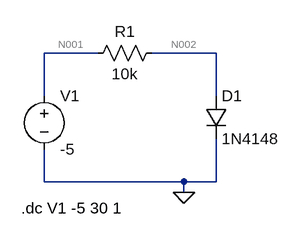
[diagram p0: schematic 1_1-10kohm.asc]
1_1-10kohm.asc, the LTspice schematic file:
Version 4
SHEET 1 880 680
WIRE 176 64 96 64
WIRE 352 64 256 64
WIRE 96 128 96 64
WIRE 352 128 352 64
WIRE 96 256 96 208
WIRE 304 256 96 256
WIRE 352 256 352 192
WIRE 352 256 304 256
WIRE 304 272 304 256
FLAG 304 272 0
SYMBOL voltage 96 112 R0
WINDOW 123 0 0 Left 0
WINDOW 39 0 0 Left 0
SYMATTR InstName V1
SYMATTR Value -5
SYMBOL res 272 48 R90
WINDOW 0 0 56 VBottom 2
WINDOW 3 32 56 VTop 2
SYMATTR InstName R1
SYMATTR Value 10k
SYMBOL diode 336 128 R0
SYMATTR InstName D1
SYMATTR Value 1N4148
TEXT 62 296 Left 2 !.dc V1 -5 30 1

The netlist it stands for:
* 1_1-10kohm.asc
V1 N001 0 -5
R1 N002 N001 10k
D1 N002 0 1N4148
.model D D
.lib standard.dio
.dc V1 -5 30 1
.backanno
.end

* Results of the author's LTspice run, read from the files saved beside the schematic
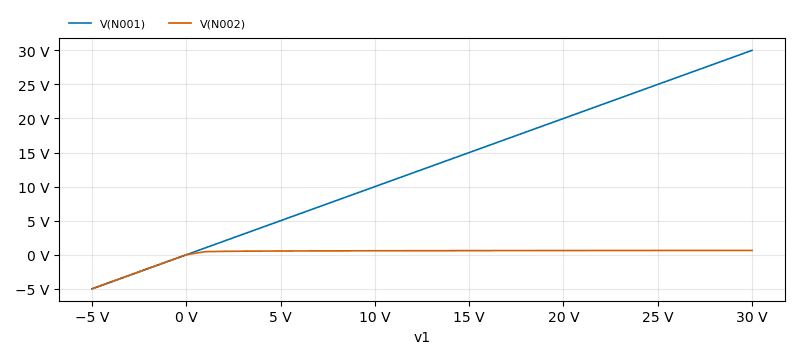
[diagram p1: DC transfer characteristic of 1_1-10kohm.asc, plotted from the saved traces]
* DC transfer characteristic, 1 run:
*   V(N001): -5 V at v1=-5 V, 30 V at v1=30 V, min -5 V, max 30 V
*   V(N002): -5 V at v1=-5 V, 634.7 mV at v1=30 V, min -5 V, max 634.7 mV